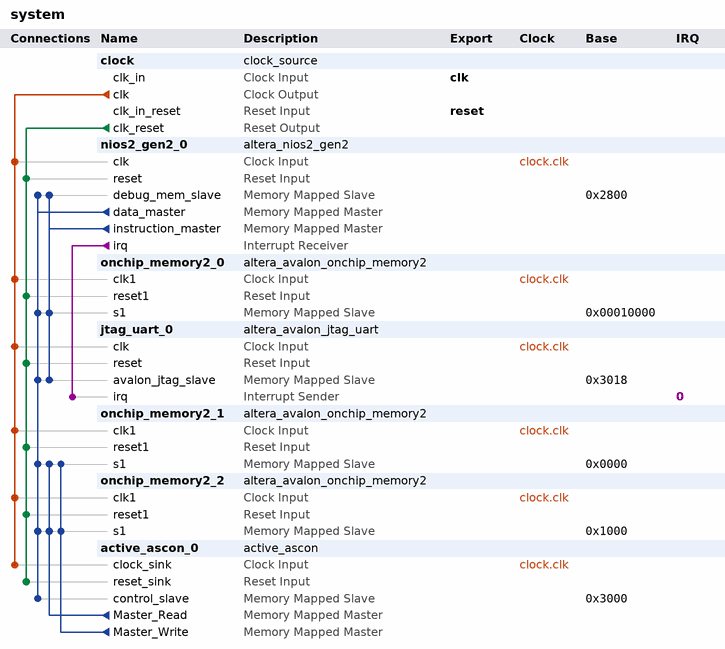
[diagram p0: system contents]
# Platform Designer (Qsys) system system, Cyclone V 5CSXFC6D6F31C6
# Parameters at their usual value, and those the tool derives, are not listed.
package require -exact qsys 18.1
create_system system
set_project_property DEVICE_FAMILY {Cyclone V}
set_project_property DEVICE 5CSXFC6D6F31C6

add_instance clock clock_source 18.1
set_instance_parameter_value clock clockFrequency 50000000

add_instance nios2_gen2_0 altera_nios2_gen2 18.1
set_instance_parameter_value nios2_gen2_0 dcache_size 2048
set_instance_parameter_value nios2_gen2_0 exceptionSlave onchip_memory2_0.s1
set_instance_parameter_value nios2_gen2_0 icache_size 4096
set_instance_parameter_value nios2_gen2_0 impl Tiny
set_instance_parameter_value nios2_gen2_0 resetSlave onchip_memory2_0.s1

add_instance onchip_memory2_0 altera_avalon_onchip_memory2 18.1
set_instance_parameter_value onchip_memory2_0 dataWidth 32
set_instance_parameter_value onchip_memory2_0 dualPort false
set_instance_parameter_value onchip_memory2_0 initMemContent true
set_instance_parameter_value onchip_memory2_0 initializationFileName onchip_mem.hex
set_instance_parameter_value onchip_memory2_0 memorySize 32768

add_instance jtag_uart_0 altera_avalon_jtag_uart 18.1
set_instance_parameter_value jtag_uart_0 simInteractiveOptions NO_INTERACTIVE_WINDOWS

add_instance onchip_memory2_1 altera_avalon_onchip_memory2 18.1
set_instance_parameter_value onchip_memory2_1 dataWidth 32
set_instance_parameter_value onchip_memory2_1 dualPort false
set_instance_parameter_value onchip_memory2_1 initMemContent true
set_instance_parameter_value onchip_memory2_1 initializationFileName onchip_mem.hex
set_instance_parameter_value onchip_memory2_1 memorySize 4096

add_instance onchip_memory2_2 altera_avalon_onchip_memory2 18.1
set_instance_parameter_value onchip_memory2_2 dataWidth 32
set_instance_parameter_value onchip_memory2_2 dualPort false
set_instance_parameter_value onchip_memory2_2 initMemContent true
set_instance_parameter_value onchip_memory2_2 initializationFileName onchip_mem.hex
set_instance_parameter_value onchip_memory2_2 memorySize 4096

add_instance active_ascon_0 active_ascon 1.0
set_instance_parameter_value active_ascon_0 ROUNDS_PER_CYCLE0 3
set_instance_parameter_value active_ascon_0 ROUNDS_PER_CYCLE1 2

# connections
add_connection clock.clk active_ascon_0.clock_sink clock
add_connection clock.clk jtag_uart_0.clk clock
add_connection clock.clk nios2_gen2_0.clk clock
add_connection clock.clk onchip_memory2_0.clk1 clock
add_connection clock.clk onchip_memory2_1.clk1 clock
add_connection clock.clk onchip_memory2_2.clk1 clock
add_connection clock.clk_reset active_ascon_0.reset_sink reset
add_connection clock.clk_reset jtag_uart_0.reset reset
add_connection clock.clk_reset nios2_gen2_0.reset reset
add_connection clock.clk_reset onchip_memory2_0.reset1 reset
add_connection clock.clk_reset onchip_memory2_1.reset1 reset
add_connection clock.clk_reset onchip_memory2_2.reset1 reset
add_connection active_ascon_0.Master_Read onchip_memory2_1.s1 avalon
set_connection_parameter_value active_ascon_0.Master_Read/onchip_memory2_1.s1 baseAddress 0x0000
add_connection active_ascon_0.Master_Read onchip_memory2_2.s1 avalon
set_connection_parameter_value active_ascon_0.Master_Read/onchip_memory2_2.s1 baseAddress 0x1000
add_connection active_ascon_0.Master_Write onchip_memory2_1.s1 avalon
set_connection_parameter_value active_ascon_0.Master_Write/onchip_memory2_1.s1 baseAddress 0x0000
add_connection active_ascon_0.Master_Write onchip_memory2_2.s1 avalon
set_connection_parameter_value active_ascon_0.Master_Write/onchip_memory2_2.s1 baseAddress 0x1000
add_connection nios2_gen2_0.data_master active_ascon_0.control_slave avalon
set_connection_parameter_value nios2_gen2_0.data_master/active_ascon_0.control_slave baseAddress 0x3000
add_connection nios2_gen2_0.data_master jtag_uart_0.avalon_jtag_slave avalon
set_connection_parameter_value nios2_gen2_0.data_master/jtag_uart_0.avalon_jtag_slave baseAddress 0x3018
add_connection nios2_gen2_0.data_master nios2_gen2_0.debug_mem_slave avalon
set_connection_parameter_value nios2_gen2_0.data_master/nios2_gen2_0.debug_mem_slave baseAddress 0x2800
add_connection nios2_gen2_0.data_master onchip_memory2_0.s1 avalon
set_connection_parameter_value nios2_gen2_0.data_master/onchip_memory2_0.s1 baseAddress 0x00010000
add_connection nios2_gen2_0.data_master onchip_memory2_1.s1 avalon
set_connection_parameter_value nios2_gen2_0.data_master/onchip_memory2_1.s1 baseAddress 0x0000
add_connection nios2_gen2_0.data_master onchip_memory2_2.s1 avalon
set_connection_parameter_value nios2_gen2_0.data_master/onchip_memory2_2.s1 baseAddress 0x1000
add_connection nios2_gen2_0.instruction_master jtag_uart_0.avalon_jtag_slave avalon
set_connection_parameter_value nios2_gen2_0.instruction_master/jtag_uart_0.avalon_jtag_slave baseAddress 0x3018
add_connection nios2_gen2_0.instruction_master nios2_gen2_0.debug_mem_slave avalon
set_connection_parameter_value nios2_gen2_0.instruction_master/nios2_gen2_0.debug_mem_slave baseAddress 0x2800
add_connection nios2_gen2_0.instruction_master onchip_memory2_0.s1 avalon
set_connection_parameter_value nios2_gen2_0.instruction_master/onchip_memory2_0.s1 baseAddress 0x00010000
add_connection nios2_gen2_0.irq jtag_uart_0.irq interrupt
set_connection_parameter_value nios2_gen2_0.irq/jtag_uart_0.irq irqNumber 0

# exported interfaces
add_interface clk clock sink
set_interface_property clk EXPORT_OF clock.clk_in
add_interface reset reset sink
set_interface_property reset EXPORT_OF clock.clk_in_reset

set_interconnect_requirement {$system} qsys_mm.clockCrossingAdapter HANDSHAKE
set_interconnect_requirement {$system} qsys_mm.enableEccProtection FALSE
set_interconnect_requirement {$system} qsys_mm.insertDefaultSlave FALSE
set_interconnect_requirement {$system} qsys_mm.maxAdditionalLatency 1

save_system system.qsys
